# EAGLE design rascsi (EAGLE 7.7.0)
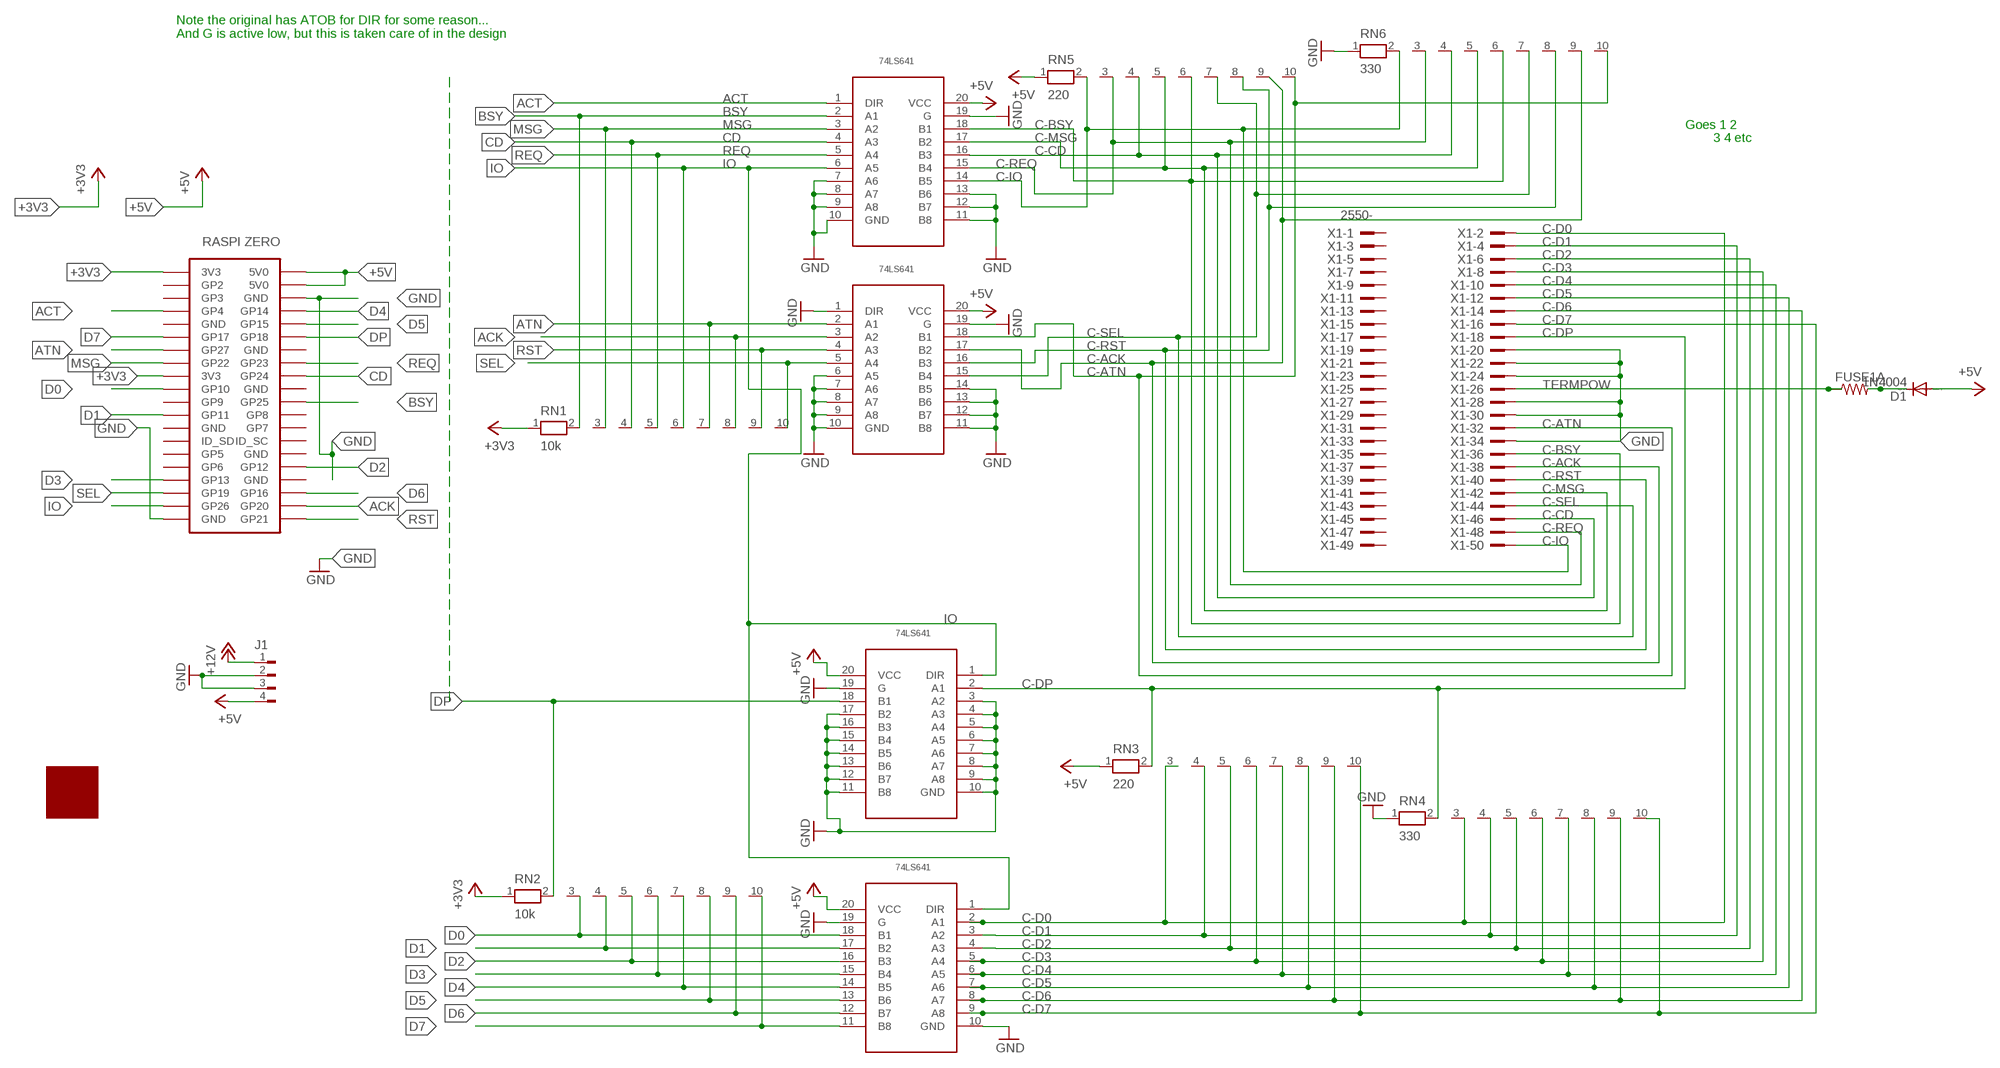
[diagram p0: schematic, sheet 1]

## Parts
D1  1N4004  [DO41-10]
FUSE1A  R-US_0204/7  [0204/7]
J1  FLOP-4W  [FLOP-4V]
RN1  10k  RN09  [RN-10]
RN2  10k  RN09  [RN-10]
RN3  220  RN09  [RN-10]
RN4  330  RN09  [RN-10]
RN5  220  RN09  [RN-10]
RN6  330  RN09  [RN-10]
U11  SN74LS641-1SC  [SOIC20S]
U22  SN74LS641-1SC  [SOIC20S]
U33  SN74LS641-1SC  [SOIC20S]
U44  SN74LS641-1SC  [SOIC20S]
U$1  ZERO  [ZERO]
U$2  LOGO  [LOGO]
X1  2550-  [PAK100/2500-50]

## Nets
+3V3: RN1.1 RN2.1 U$1.1(3V3) U$1.17(3V3)
+5V: D1.A J1.4 RN3.1 RN5.1 U11.20(VCC) U22.20(VCC) U33.20(VCC) U44.20(VCC) U$1.2(5V0) U$1.4(5V0)
+12V: J1.1
ACK: RN1.8 U22.3(A2) U$1.38(GP20)
ACT: U11.1(DIR) U$1.7(GP4)
ATN: RN1.7 U22.2(A1) U$1.13(GP27)
BSY: RN1.2 U11.2(A1) U$1.22(GP25)
C-ACK: RN5.9 RN6.9 U22.17(B2) X1.38
C-ATN: RN5.10 RN6.10 U22.18(B1) X1.32
C-BSY: RN5.6 RN6.6 U11.18(B1) X1.36
C-CD: RN5.4 RN6.4 U11.16(B3) X1.46
C-D0: RN3.3 RN4.3 U44.2(A1) X1.2
C-D1: RN3.4 RN4.4 U44.3(A2) X1.4
C-D2: RN3.5 RN4.5 U44.4(A3) X1.6
C-D3: RN3.6 RN4.6 U44.5(A4) X1.8
C-D4: RN3.7 RN4.7 U44.6(A5) X1.10
C-D5: RN3.8 RN4.8 U44.7(A6) X1.12
C-D6: RN3.9 RN4.9 U44.8(A7) X1.14
C-D7: RN3.10 RN4.10 U44.9(A8) X1.16
C-DP: RN3.2 RN4.2 U33.2(A1) X1.18
C-IO: RN5.2 RN6.2 U11.14(B5) X1.50
C-MSG: RN5.5 RN6.5 U11.17(B2) X1.42
C-REQ: RN5.3 RN6.3 U11.15(B4) X1.48
C-RST: RN5.8 RN6.8 U22.16(B3) X1.40
C-SEL: RN5.7 RN6.7 U22.15(B4) X1.44
CD: RN1.4 U11.4(A3) U$1.18(GP24)
D0: RN2.3 U44.18(B1) U$1.19(GP10)
D1: RN2.4 U44.17(B2) U$1.23(GP11)
D2: RN2.5 U44.16(B3) U$1.32(GP12)
D3: RN2.6 U44.15(B4) U$1.33(GP13)
D4: RN2.7 U44.14(B5) U$1.8(GP14)
D5: RN2.8 U44.13(B6) U$1.10(GP15)
D6: RN2.9 U44.12(B7) U$1.36(GP16)
D7: RN2.10 U44.11(B8) U$1.11(GP17)
DP: RN2.2 U33.18(B1) U$1.12(GP18)
GND: J1.2 J1.3 RN4.1 RN6.1 U11.7(A6) U11.8(A7) U11.9(A8) U11.10(GND) U11.11(B8) U11.12(B7) U11.13(B6) U11.19(G) U22.1(DIR) U22.6(A5) U22.7(A6) U22.8(A7) U22.9(A8) U22.10(GND) U22.11(B8) U22.12(B7) U22.13(B6) U22.14(B5) U22.19(G) U33.3(A2) U33.4(A3) U33.5(A4) U33.6(A5) U33.7(A6) U33.8(A7) U33.9(A8) U33.10(GND) U33.11(B8) U33.12(B7) U33.13(B6) U33.14(B5) U33.15(B4) U33.16(B3) U33.17(B2) U33.19(G) U44.10(GND) U44.19(G) U$1.6(GND) U$1.39(GND) X1.20 X1.22 X1.24 X1.28 X1.30 X1.34
IO: RN1.6 U11.6(A5) U33.1(DIR) U44.1(DIR) U$1.37(GP26)
MSG: RN1.3 U11.3(A2) U$1.15(GP22)
N$4: D1.C FUSE1A.2
REQ: RN1.5 U11.5(A4) U$1.16(GP23)
RST: RN1.9 U22.4(A3) U$1.40(GP21)
SEL: RN1.10 U22.5(A4) U$1.35(GP19)
TERMPOW: FUSE1A.1 X1.26
Unconnected: U$1.3(GP2) U$1.5(GP3) U$1.9(GND) U$1.14(GND) U$1.20(GND) U$1.21(GP9) U$1.24(GP8) U$1.25(GND) U$1.26(GP7) U$1.27(ID_SD) U$1.28(ID_SC) U$1.29(GP5) U$1.30(GND) U$1.31(GP6) U$1.34(GND) X1.1 X1.3 X1.5 X1.7 X1.9 X1.11 X1.13 X1.15 X1.17 X1.19 X1.21 X1.23 X1.25 X1.27 X1.29 X1.31 X1.33 X1.35 X1.37 X1.39 X1.41 X1.43 X1.45 X1.47 X1.49

## Notes on the sheet
- Note the original has ATOB for DIR for some reason...
  And G is active low, but this is taken care of in the design
- Goes 1 2
- 3 4 etc

## Library data of the parts
D1 = diode:1N4004: DIODE general purpose rectifier, 1 A
FUSE1A = resistor:R-US_: RESISTOR, American symbol
J1 = con-amp:FLOP-4W: MATE N-LOCK Floppy / HDD conector Distributor: Bürklin 71F972
RN1-RN6 = resistor-net:RN09: RESISTOR NETWORK; OC_FARNELL: unknown; OC_NEWARK: unknown
U11 U22 U33 U44 = capstuff:SN74LS641-1: Octual Bus Trans.
U$1 = RasPi:ZERO: Raspbery Pi Foundation Zero https://www.raspberrypi.org/products/pi-zero/
U$2 = capstuff:LOGO
X1 = con-3m:2550-: 3M (TM) Pak 100 4-Wall Header Source: 3M; OC_FARNELL: unknown; OC_NEWARK: unknown

## Board
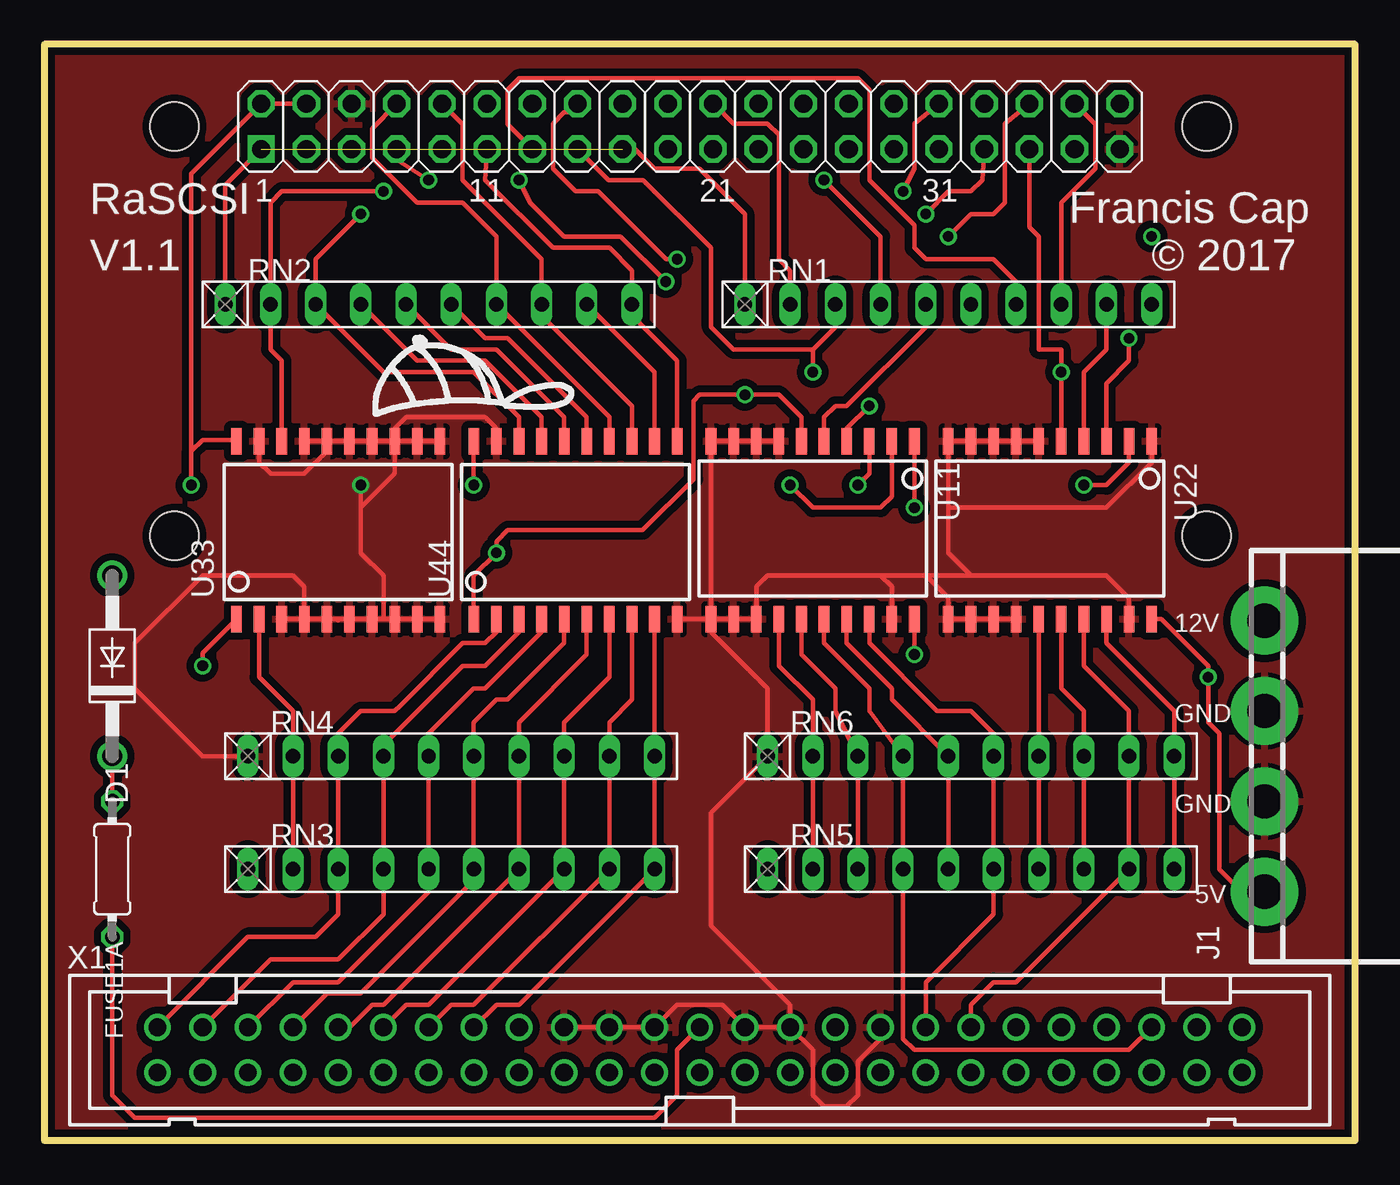
[diagram p1: board, top side]
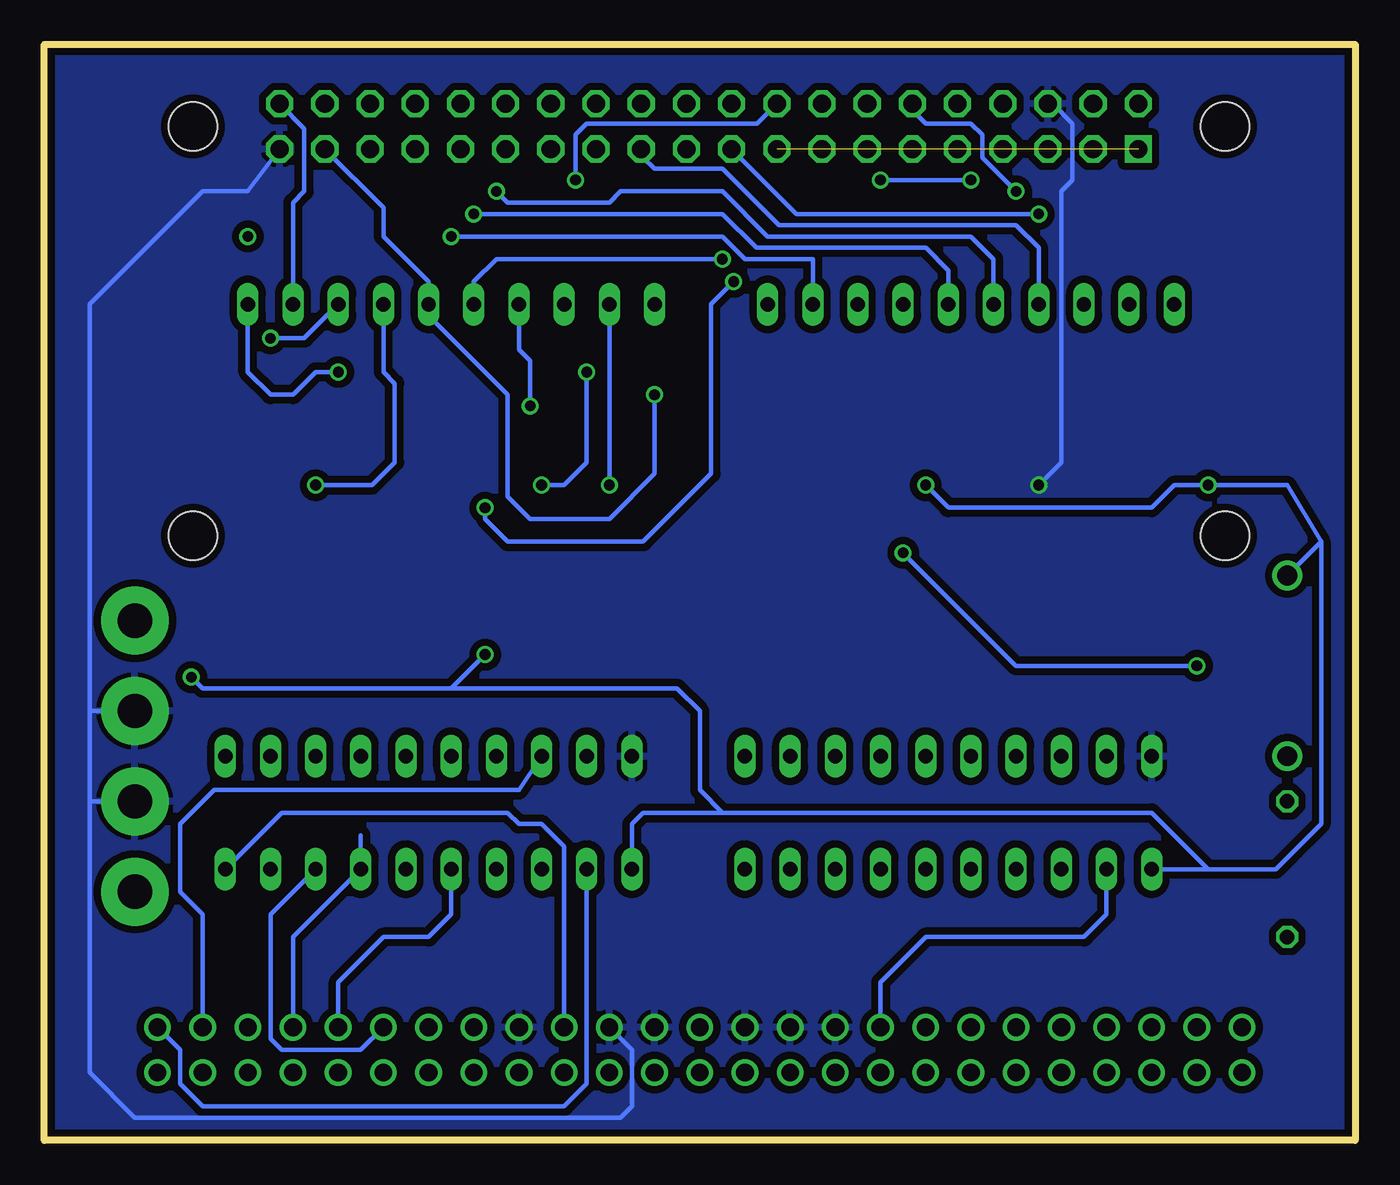
[diagram p2: board, bottom side, seen from below]

Size 73.66 x 61.59 mm. Coordinates in mm from the lower left corner, seen from the top.
Outline: 0,61.59 0,0 73.66,0 73.66,61.59 0,61.59
Copper layers (1*16): Top 0.0356mm / dielectric 1.5011mm / Bottom 0.0356mm
Design rules "LaenPCBOrder": minimum track width 6mil, minimum drill 13mil, track to track 6mil, track to pad 6mil, pad to pad 6mil, via to via 6mil, smd to smd 6mil, copper to edge 15mil, drill to drill 6mil, minimum pad ring 7mil, minimum via ring 7mil, stop-mask expansion 3mil, vias tented up to drill 0mil, thermal gap 10mil

### Footprints (pad centres in the part's own frame; a part is rotated, then mirrored left to right if it is on the bottom)
DO41-10 = drill 1.118: A 5.08,0; C -5.08,0
0204/7 = drill 0.813 octagon: 1 -3.81,0; 2 3.81,0
FLOP-4V = drill 1.93 pad 3.81: 1 7.62,0; 2 2.54,0; 3 -2.54,0; 4 -7.62,0
RN-10 = drill 0.813 long: 1 -11.43,0; 2 -8.89,0; 3 -6.35,0; 4 -3.81,0; 5 -1.27,0; 6 1.27,0; 7 3.81,0; 8 6.35,0; 9 8.89,0; 10 11.43,0
SOIC20S = smd 0.6 x 1.5: 1 -5.715,-5; 2 -4.445,-5; 3 -3.175,-5; 4 -1.905,-5; 5 -0.635,-5; 6 0.635,-5; 7 1.905,-5; 8 3.175,-5; 9 4.445,-5; 10 5.715,-5; 11 5.715,5; 12 4.445,5; 13 3.175,5; 14 1.905,5; 15 0.635,5; 16 -0.635,5; 17 -1.905,5; 18 -3.175,5; 19 -4.445,5; 20 -5.715,5
ZERO = drill 1.016 square: 1 8.37,25.24 | drill 1.016 octagon: 2 8.37,27.78; 3 10.91,25.24; 4 10.91,27.78; 5 13.45,25.24; 6 13.45,27.78; 7 15.99,25.24; 8 15.99,27.78; 9 18.53,25.24; 10 18.53,27.78; 11 21.07,25.24; 12 21.07,27.78; 13 23.61,25.24; 14 23.61,27.78; 15 26.15,25.24; 16 26.15,27.78; 17 28.69,25.24; 18 28.69,27.78; 19 31.23,25.24; 20 31.23,27.78; 21 33.77,25.24; 22 33.77,27.78; 23 36.31,25.24; 24 36.31,27.78; 25 38.85,25.24; 26 38.85,27.78; 27 41.39,25.24; 28 41.39,27.78; 29 43.93,25.24; 30 43.93,27.78; 31 46.47,25.24; 32 46.47,27.78; 33 49.01,25.24; 34 49.01,27.78; 35 51.55,25.24; 36 51.55,27.78; 37 54.09,25.24; 38 54.09,27.78; 39 56.63,25.24; 40 56.63,27.78 | hole 2.75: 3.5,3.5; 3.5,26.5; 61.5,26.5; 61.5,3.5
PAK100/2500-50 = drill 1 pad 1.422: 1 -30.48,-1.27; 2 -30.48,1.27; 3 -27.94,-1.27; 4 -27.94,1.27; 5 -25.4,-1.27; 6 -25.4,1.27; 7 -22.86,-1.27; 8 -22.86,1.27; 9 -20.32,-1.27; 10 -20.32,1.27; 11 -17.78,-1.27; 12 -17.78,1.27; 13 -15.24,-1.27; 14 -15.24,1.27; 15 -12.7,-1.27; 16 -12.7,1.27; 17 -10.16,-1.27; 18 -10.16,1.27; 19 -7.62,-1.27; 20 -7.62,1.27; 21 -5.08,-1.27; 22 -5.08,1.27; 23 -2.54,-1.27; 24 -2.54,1.27; 25 0,-1.27; 26 0,1.27; 27 2.54,-1.27; 28 2.54,1.27; 29 5.08,-1.27; 30 5.08,1.27; 31 7.62,-1.27; 32 7.62,1.27; 33 10.16,-1.27; 34 10.16,1.27; 35 12.7,-1.27; 36 12.7,1.27; 37 15.24,-1.27; 38 15.24,1.27; 39 17.78,-1.27; 40 17.78,1.27; 41 20.32,-1.27; 42 20.32,1.27; 43 22.86,-1.27; 44 22.86,1.27; 45 25.4,-1.27; 46 25.4,1.27; 47 27.94,-1.27; 48 27.94,1.27; 49 30.48,-1.27; 50 30.48,1.27

### Placement (x,y rotation side)
D1  3.81,26.67 90 top
FUSE1A  3.81,15.24 90 top
J1  68.58,21.59 90 top
RN1  50.8,46.99 0 top
RN2  21.59,46.99 0 top
RN3  22.86,15.24 0 top
RN4  22.86,21.59 0 top
RN5  52.07,15.24 0 top
RN6  52.07,21.59 0 top
U11  43.18,34.29 180 top
U22  56.51,34.29 180 top
U33  16.51,34.29 0 top
U44  29.84,34.29 0 top
U$1  3.81,30.48 0 top
U$2  18.41,40.64 0 top
X1  36.83,5.08 0 top

### Tracks (layer width: path | path; a pad name or v marks a point on that pad's centre or on a via)
+3V3  (1 unrouted)
  Top 0.254: RN2.1 10.16,53.7 U$1.1 | U$1.17 33.18,55.72 34.29,54.61 36.83,54.61 39.37,52.07 RN1.1
+5V  (via drill 0.6)
  Top 0.254: U$1.4 U$1.2 8.26,54.33 8.26,38.73 | v24.13,36.83 U44.20 | v8.26,36.83 8.26,38.73 | 8.26,38.73 8.89,39.37 10.71,39.37 U33.20 | v48.89,27.3 U11.20 | U22.20 62.79,29.29 65.41,26.67 v65.41,26.03 65.41,23.49 66.04,22.86 66.04,15.24 67.31,13.97 J1.4
  Bottom 0.254: 1.9,33.66 3.81,36.83 v8.26,36.83 10.16,36.83 11.43,35.56 22.86,35.56 v24.13,36.83 | 1.9,33.66 1.9,17.78 4.45,15.24 8.26,15.24 | 8.26,15.24 RN3.1 | RN5.1 40.64,17.78 40,18.41 35.56,18.41 | 35.56,18.41 11.43,18.41 8.26,15.24 | 35.56,18.41 36.83,19.69 36.83,24.13 38.1,25.4 50.8,25.4 | 50.8,25.4 64.77,25.4 v65.41,26.03 | 1.9,33.66 D1.A | 50.8,25.4 v48.89,27.3
ACK  (via drill 0.6)
  Top 0.254: RN1.8 57.15,52.7 59.05,54.61 59.05,57.11 U$1.38 | U22.3 59.69,42.55 60.96,43.81 v60.96,45.09
  Bottom 0.254: v60.96,45.09 59.05,45.09 RN1.8
ACT  (via drill 0.6)
  Top 0.254: U$1.7 19.8,55.13 v21.59,53.97 | v26.67,53.97 27.3,52.7 29.21,50.8 32.38,50.8 v34.92,48.26 | v48.89,35.56 U11.1
  Bottom 0.254: v21.59,53.97 v26.67,53.97 | v34.92,48.26 36.2,46.99 36.2,37.46 40,33.66 47.62,33.66 48.89,34.92 v48.89,35.56
ATN  (via drill 0.6)
  Top 0.254: RN1.7 54.61,48.26 53.34,49.53 49.53,49.53 48.89,50.16 48.89,51.44 46.35,53.97 46.35,59.05 45.72,59.69 26.67,59.69 26.04,59.05 26.04,57.11 U$1.13 | U22.2 60.96,38.1 59.69,36.83 v58.42,36.83
  Bottom 0.254: RN1.7 54.61,43.18 53.97,42.55 53.97,38.1 55.24,36.83 v58.42,36.83
BSY  (via drill 0.6)
  Top 0.254: U$1.22 37.62,58.26 38.73,57.15 40.64,57.15 41.27,56.52 41.27,49.53 41.91,48.89 RN1.2 | U11.2 47.62,36.2 46.99,35.56 43.18,35.56 v41.91,36.83
  Bottom 0.254: v41.91,36.83 RN1.2
C-ACK
  Top 0.254: X1.38 52.07,7.62 53.34,8.89 54.61,8.89 RN5.9 RN6.9 60.96,24.13 58.42,26.67 U22.17
C-ATN
  Top 0.254: RN5.10 RN6.10 63.5,24.13 59.69,27.94 U22.18
  Bottom 0.254: X1.32 44.45,16.51 45.72,17.78 46.99,17.78 47.62,18.41 60.32,18.41 RN5.10
C-BSY
  Top 0.254: X1.36 49.53,8.89 53.34,12.7 RN5.6 RN6.6 53.34,22.86 52.07,24.13 50.16,24.13 46.35,27.94 U11.18
C-CD
  Top 0.254: X1.46 60.96,5.08 48.89,5.08 48.26,5.71 RN5.4 RN6.4 46.35,24.13 46.35,25.4 43.81,27.94 U11.16
C-D0
  Top 0.254: X1.2 11.43,11.43 15.24,11.43 16.51,12.7 RN3.3 RN4.3 16.51,22.86 17.78,24.13 19.68,24.13 20,24.45 23.5,27.94 24.77,27.94 25.4,28.57 U44.2
C-D1
  Top 0.254: X1.4 12.7,10.16 16.51,10.16 19.05,12.7 RN3.4 RN4.4 19.05,22.23 23.5,26.67 24.77,26.67 26.67,28.57 U44.3
C-D2
  Top 0.254: X1.6 13.97,8.89 16.51,8.89 21.59,13.97 RN3.5 RN4.5 21.59,22.86 24.13,25.4 24.77,25.4 27.94,28.57 U44.4
C-D3
  Top 0.254: X1.8 15.88,8.25 17.78,8.25 24.13,14.6 RN3.6 RN4.6 24.13,23.49 25.4,24.77 26.04,24.77 29.21,27.94 U44.5
C-D4
  Top 0.254: X1.10 17.14,6.35 18.41,7.62 19.05,7.62 RN3.7 RN4.7 26.67,23.49 30.48,27.3 U44.6
C-D5
  Top 0.254: X1.12 20.32,7.62 21.59,7.62 RN3.8 RN4.8 29.21,23.49 31.75,26.03 U44.7
C-D6
  Top 0.254: X1.14 22.86,7.62 24.13,7.62 RN3.9 RN4.9 31.75,23.49 33.02,24.77 U44.8
C-D7
  Top 0.254: X1.16 25.4,7.62 26.67,7.62 RN3.10 RN4.10 U44.9
C-DP
  Top 0.254: RN3.2 RN4.2 13.97,24.13 12.07,26.03 U33.2
  Bottom 0.254: RN3.2 13.97,12.7 15.24,11.43 24.13,11.43 26.67,8.89 X1.18
C-IO
  Top 0.254: RN5.2 RN6.2 43.18,24.77 41.27,26.67 U11.14
  Bottom 0.254: RN5.2 43.18,3.17 44.45,1.9 64.77,1.9 66.04,3.17 66.04,5.08 X1.50
C-MSG
  Top 0.254: RN5.5 RN6.5 47.62,24.77 47.62,25.4 45.08,27.94 U11.17
  Bottom 0.254: RN5.5 50.8,12.7 52.07,11.43 54.61,11.43 57.15,8.89 X1.42
C-REQ
  Top 0.254: RN5.3 RN6.3 44.45,24.13 44.45,25.4 42.54,27.3 U11.15
  Bottom 0.254: RN6.3 46.99,19.69 64.14,19.69 66.04,17.78 66.04,13.97 64.77,12.7 X1.48
C-RST
  Top 0.254: RN5.8 RN6.8 58.42,24.13 57.15,25.4 U22.16
  Bottom 0.254: X1.40 55.88,5.08 60.32,5.08 60.96,5.71 60.96,12.7 RN5.8
C-SEL
  Top 0.254: RN5.7 RN6.7 U22.15
  Bottom 0.254: 55.88,17.14 RN5.7 59.69,11.43 X1.44
CD  (via drill 0.6)
  Top 0.254: RN1.4 46.99,50.8 v43.81,53.97 | U11.4 45.08,40 v46.35,41.27
  Bottom 0.254: v46.35,41.27 46.35,43.81 46.99,44.45 RN1.4 | v43.81,53.97 43.81,56.52 43.18,57.15 33.61,57.15 U$1.18
D0  (via drill 0.6)
  Top 0.254: v17.78,52.07 15.24,49.53 RN2.3 19.05,43.18 24.13,43.18 26.67,40.64 U44.18
  Bottom 0.254: v17.78,52.07 31.39,52.07 U$1.19
D1
  Top 0.254: RN2.4 20.96,43.81 24.77,43.81 27.94,40.64 U44.17
  Bottom 0.254: RN2.4 17.78,50.16 19.05,51.44 32.38,51.44 35.56,54.61 39.37,54.61 40,55.25 40,55.61 U$1.23
D2  (via drill 0.6)
  Top 0.254: RN2.5 22.86,44.45 25.4,44.45 29.21,40.64 U44.16 | U$1.32 48.89,57.15 48.89,54.61 v48.26,53.34
  Bottom 0.254: RN2.5 20.32,49.53 21.59,50.8 33.02,50.8 35.56,53.34 41.27,53.34 41.91,52.7 47.62,52.7 v48.26,53.34
D3  (via drill 0.6)
  Top 0.254: RN2.6 24.77,45.09 26.04,45.09 30.48,40.64 U44.15 | v49.53,52.07 50.8,53.34 52.07,53.34 52.7,53.97 U$1.33
  Bottom 0.254: RN2.6 22.86,48.89 24.13,50.16 33.65,50.16 35.56,52.07 v49.53,52.07
D4
  Top 0.254: U$1.8 18.41,56.88 18.41,55.25 20.96,52.7 23.5,52.7 25.4,50.8 RN2.7 31.75,40.64 U44.14
D5
  Top 0.254: U$1.10 23.5,57.11 23.5,53.97 27.94,49.53 RN2.8 27.94,46.36 33.02,41.27 U44.13
D6  (via drill 0.6)
  Top 0.254: RN2.9 34.29,43.18 U44.12 | v50.8,50.8 52.07,52.07 53.34,52.07 53.97,52.7 53.97,57.15 U$1.36
  Bottom 0.254: RN2.9 30.48,49.53 34.29,49.53 35.56,50.8 v50.8,50.8
D7
  Top 0.254: U$1.11 24.77,53.97 28.57,50.16 31.75,50.16 33.02,48.89 RN2.10 33.02,46.36 35.56,43.81 U44.11
DP  (via drill 0.6)
  Top 0.254: v19.05,53.34 13.34,53.34 12.7,52.7 RN2.2 12.7,44.45 13.34,43.81 U33.18
  Bottom 0.254: v19.05,53.34 20.96,55.25 20.96,56.52 21.59,57.15 24.13,57.15 24.77,57.78 24.77,58.14 U$1.12
GND  (via drill 0.6)
  Top 0.254: 19.05,29.29 U33.8 U33.9 U33.10 | 19.05,29.29 U33.7 | U33.4 U33.3 | RN4.1 8.89,21.59 5.08,25.4 5.08,27.94 8.89,31.75 13.97,31.75 14.61,31.12 U33.4 | U33.17 U33.16 | U33.16 U33.15 U33.14 U33.13 | U33.13 U33.12 U33.11 | X1.20 X1.22 X1.24 35.56,7.62 38.1,7.62 X1.28 X1.30 | X1.30 41.91,7.62 37.46,12.06 37.46,18.41 RN6.1 40.64,25.4 37.46,28.57 U11.11 | U11.11 U11.12 U11.13 40,31.12 40.64,31.75 46.99,31.75 | X1.34 46.99,5.71 45.72,4.45 45.72,2.54 45.08,1.9 43.81,1.9 43.18,2.54 43.18,5.08 X1.30 | U11.7 U11.8 U11.9 U11.10 U11.11 | U22.6 U22.7 U22.8 U22.9 U22.10 50.8,35.56 | U33.4 U33.5 U33.6 U33.7 | U33.7 16.43,29.29 16.51,29.21 16.51,29.29 U33.7 | U33.19 12.07,38.1 12.7,37.46 14.61,37.46 15.88,38.73 U33.16 | v17.78,36.83 17.78,35.56 | 17.78,35.56 17.78,33.02 19.05,31.75 19.05,29.29 | U33.13 19.68,40 20.32,40.64 24.77,40.64 25.4,40 U44.19 | U33.13 19.68,37.46 17.78,35.56 | U44.10 U11.11 | 46.99,31.75 47.62,31.12 U11.19 | 46.99,31.75 49.53,31.75 | 49.53,31.75 50.8,30.48 U22.11 U22.12 U22.13 U22.14 | 50.8,35.56 50.8,33.02 52.07,31.75 | U22.19 60.96,30.48 59.69,31.75 52.07,31.75 | 52.07,31.75 49.53,31.75 | 50.8,35.56 59.69,35.56 62.23,38.1 U22.1
  Bottom 0.254: U$1.6 16.98,58.26 15.88,57.15 15.88,53.97 16.51,53.34 16.51,38.1 v17.78,36.83 | X1.30 40.64,5.08 40.64,1.9 41.27,1.27 68.58,1.27 71.12,3.81 71.12,19.05 | 71.12,19.05 71.12,24.13 | 71.12,24.13 71.12,46.99 64.77,53.34 62.23,53.34 U$1.39 | J1.2 71.12,24.13 | J1.3 71.12,19.05
  pour Top (isolate 0.406): 0.23,61.11 73.25,61.11 73.25,0.28 0.23,0.28
  pour Bottom (isolate 0.406): 0.48,61.06 73.28,61.06 73.28,0.41 0.48,0.41
IO  (via drill 0.6)
  Top 0.254: 24.05,29.21 U44.1 24.13,31.75 v25.4,33.02 25.4,33.66 26.04,34.29 33.62,34.29 36.48,37.15 36.48,41.56 36.83,41.91 v39.37,41.91 41.27,41.91 42.54,40.64 U11.6 | v8.89,26.67 8.89,27.38 U33.1
  Bottom 0.254: U$1.37 54.61,52.43 54.61,50.8 52.07,48.26 RN1.6 52.07,46.36 47.62,41.91 47.62,36.2 46.35,34.92 41.91,34.92 39.37,37.46 v39.37,41.91 | v8.89,26.67 19.05,26.67 v25.4,33.02
MSG  (via drill 0.6)
  Top 0.254: RN1.3 44.45,45.72 43.18,44.45 | 43.18,44.45 38.73,44.45 37.46,45.72 37.46,50.16 33.65,53.97 31.71,53.97 U$1.15 | U11.3 46.35,37.46 v45.72,36.83 | v43.18,43.18 43.18,44.45
  Bottom 0.254: v45.72,36.83 44.45,36.83 43.18,38.1 v43.18,43.18
N$2  (via drill 0.6)
  other vias: 62.23,50.8
N$4
  Top 0.254: D1.C FUSE1A.2
REQ  (via drill 0.6)
  Top 0.254: RN1.5 49.53,45.72 45.08,41.27 44.45,41.27 43.81,40.64 U11.5 | v35.56,49.53 34.92,49.53 31.11,53.34 29.84,53.34 28.57,54.61 28.57,57.15 29.21,57.78 29.48,57.78 U$1.16
  Bottom 0.254: RN1.5 49.53,48.26 48.26,49.53 v35.56,49.53
RST
  Top 0.254: U22.4 58.42,43.18 59.69,44.45 RN1.9
  Bottom 0.254: RN1.9 59.69,52.7 59.05,53.34 59.05,56.88 U$1.40
SEL  (via drill 0.6)
  Top 0.254: U$1.35 55.36,51.32 55.88,50.8 55.88,44.45 57.15,44.45 v57.15,43.18 U22.5
  Bottom 0.254: v57.15,43.18 58.42,43.18 59.69,41.91 60.96,41.91 62.23,43.18 RN1.10
TERMPOW
  Top 0.254: FUSE1A.1 3.81,2.54 5.08,1.27 34.29,1.27 35.56,2.54 35.56,5.08 X1.26

### Text on the board
tPlace: Francis Cap | RaSCSI | V1.1 | 12V | GND | GND | 5V
tNames: © 2017